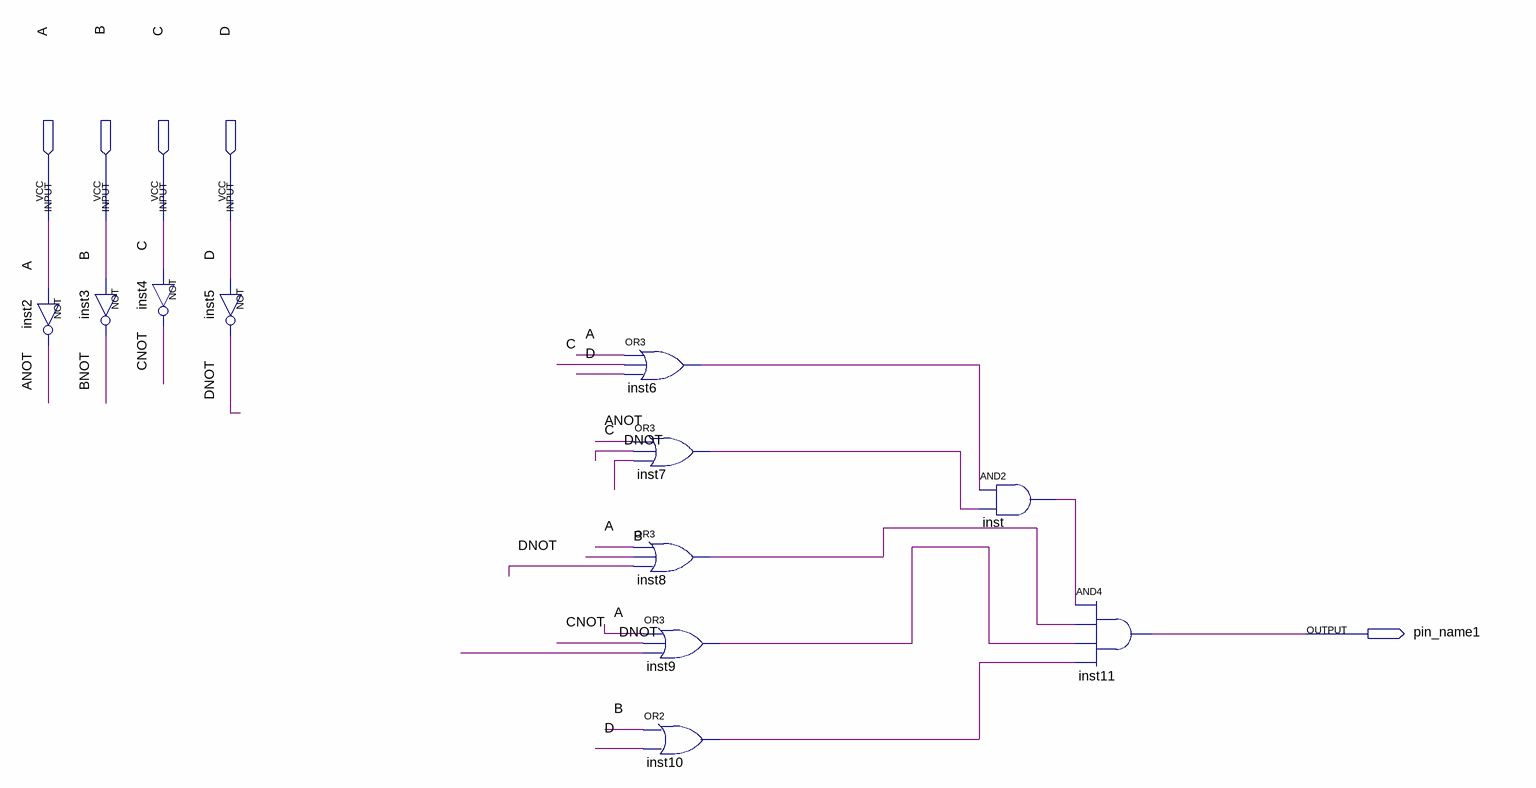
[diagram p0: schematic sheet]
// Quartus schematic output1.bdf as structural Verilog: 11 symbols, 5 pins
module output1 (
  input  A,
  input  B,
  input  C,
  input  D,
  output pin_name1
);

  wire ANOT, BNOT, CNOT, DNOT, inst6_out, inst7_out, inst8_out, inst9_out, inst10_out, inst_out;

  not inst2 (ANOT, A);
  not inst4 (CNOT, C);
  not inst3 (BNOT, B);
  not inst5 (DNOT, D);
  or inst6 (inst6_out, A, C, D);
  or inst7 (inst7_out, ANOT, C, DNOT);
  or inst8 (inst8_out, A, B, DNOT);
  or inst9 (inst9_out, A, CNOT, DNOT);
  or inst10 (inst10_out, B, D);
  and inst (inst_out, inst6_out, inst7_out);
  and inst11 (pin_name1, inst_out, inst8_out, inst9_out, inst10_out);
endmodule
